# EAGLE schematic DC_brake(PIC) (EAGLE 7.4.0)
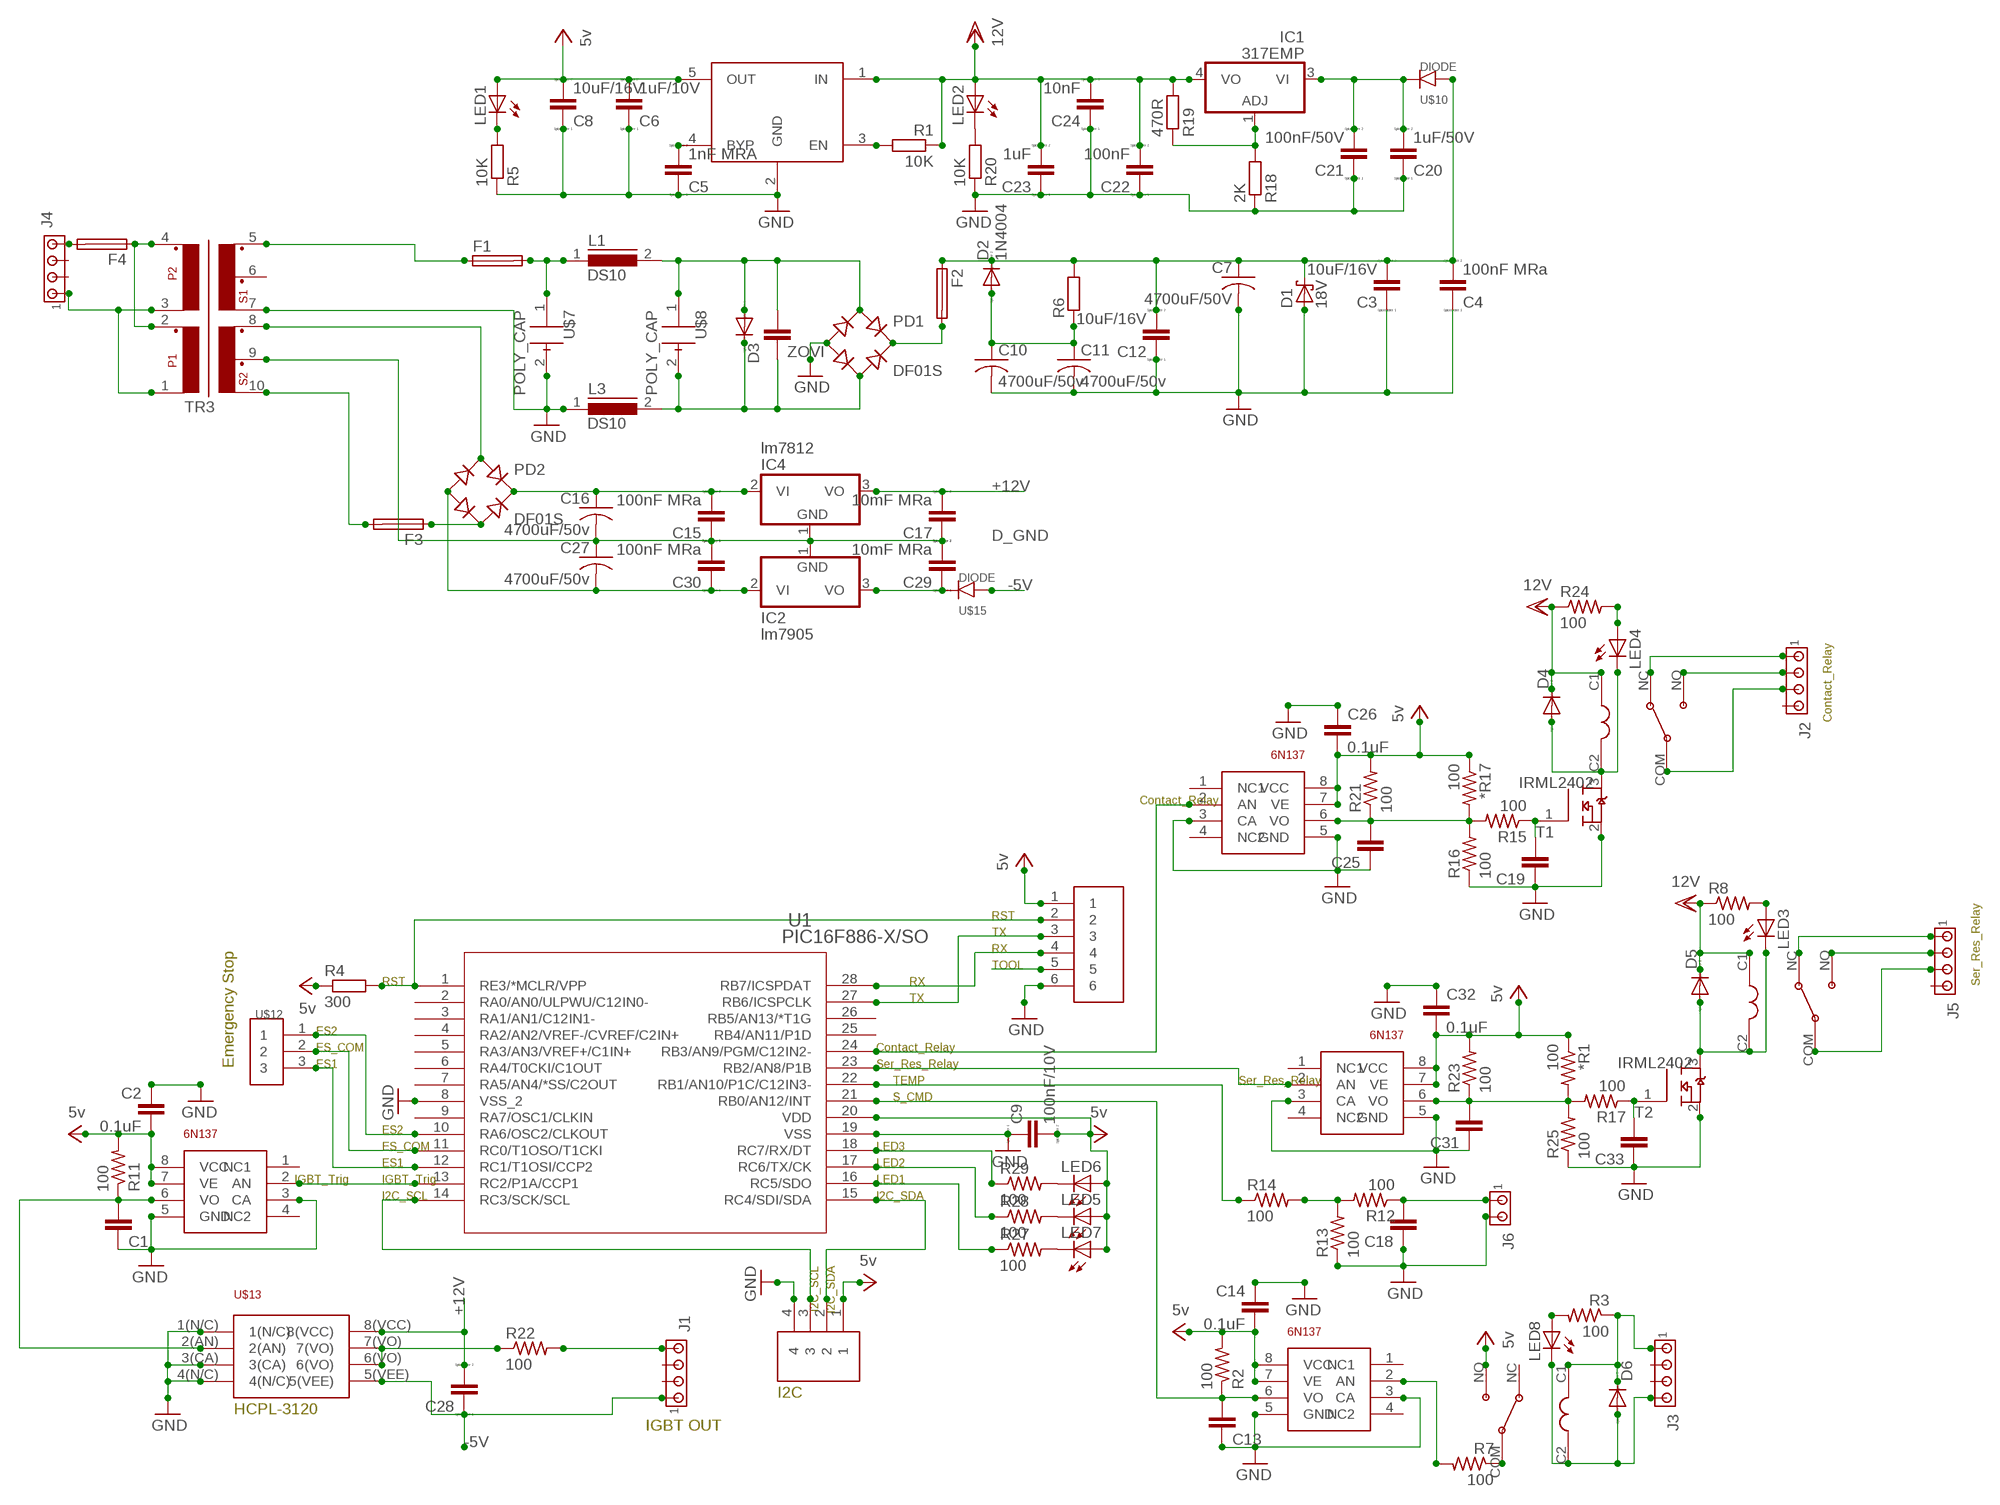
[diagram p0: schematic, sheet 1]

## Parts
*R1  100  R-US_R0603  [R0603]
*R17  100  R-US_R0603  [R0603]
C1  C-EUC0603  [C0603]
C2  0.1uF  C-EUC0603  [C0603]
C3  10uF/16V  CC1206  [C1206]
C4  100nF MRa  CC0603  [C0603]
C5  1nF MRA  CC0603  [C0603]
C6  1uF/10V  CC0603  [C0603]
C7  4700uF/50V  C-US050-075X075  [C050-075X075]
C8  10uF/16V  CC1206  [C1206]
C9  100nF/10V  CC0603  [C0603]
C10  4700uF/50v  C-US050-075X075  [C050-075X075]
C11  4700uF/50v  C-US050-075X075  [C050-075X075]
C12  10uF/16V  CC1206  [C1206]
C13  C-EUC0603  [C0603]
C14  0.1uF  C-EUC0603  [C0603]
C15  100nF MRa  CC0603  [C0603]
C16  4700uF/50v  C-US050-075X075  [C050-075X075]
C17  10mF MRa  CC0603  [C0603]
C18  C-EUC0603  [C0603]
C19  C-EUC0603  [C0603]
C20  1uF/50V  CC1206  [C1206]
C21  100nF/50V  CC0603  [C0603]
C22  100nF  CC0603  [C0603]
C23  1uF  CC0603  [C0603]
C24  10nF  CC0603  [C0603]
C25  C-EUC0603  [C0603]
C26  0.1uF  C-EUC0603  [C0603]
C27  4700uF/50v  C-US050-075X075  [C050-075X075]
C28  C  [C0805]
C29  10mF MRa  CC0603  [C0603]
C30  100nF MRa  CC0603  [C0603]
C31  C-EUC0603  [C0603]
C32  0.1uF  C-EUC0603  [C0603]
C33  C-EUC0603  [C0603]
D1  18V  SCHOTTKY-DIODESMC  [SMC]
D2  1N4004  [DO41-10]
D3  1N4933  [DO41-10]
D4  DIODE-DO214AC  [DO214AC]
D5  DIODE-DO214AC  [DO214AC]
D6  DIODE-DO214AC  [DO214AC]
F1  19560  [19560]
F2  19560  [19560]
F3  19560  [19560]
F4  19560  [19560]
IC1  317EMP  [SOT223]
IC2  lm7905  7908T  [TO220H]
IC4  lm7812  7908T  [TO220H]
J1  MTA04-156  [1X4MTA]
J2  MTA04-156  [1X4MTA]
J3  MTA04-156  [1X4MTA]
J4  MTA04-156  [1X4MTA]
J5  MTA04-156  [1X4MTA]
J6  MTA02-100  [10X02MTA]
L1  DS10  [DS10]
L3  DS10  [DS10]
LED1  LEDSML1206  [SML1206]
LED2  LEDSML1206  [SML1206]
LED3  LED3MM  [LED3MM]
LED4  LED3MM  [LED3MM]
LED5  LED3MM  [LED3MM]
LED6  LED3MM  [LED3MM]
LED7  LED3MM  [LED3MM]
LED8  LED3MM  [LED3MM]
PD1  DF01S  DBLS201G  [DBS]
PD2  DF01S  DBLS201G  [DBS]
R1  10K  R-EU_R0603  [R0603]
R2  100  R-US_R0603  [R0603]
R3  100  R-US_R0603  [R0603]
R4  300  R-EU_R0603  [R0603]
R5  10K  R-EU_R0603  [R0603]
R6  R-EU_0411/12  [0411/12]
R7  100  R-US_R0603  [R0603]
R8  100  R-US_R0603  [R0603]
R11  100  R-US_R0603  [R0603]
R12  100  R-US_R0603  [R0603]
R13  100  R-US_R0603  [R0603]
R14  100  R-US_R0603  [R0603]
R15  100  R-US_R0603  [R0603]
R16  100  R-US_R0603  [R0603]
R17  100  R-US_R0603  [R0603]
R18  2K  R-EU_R0603  [R0603]
R19  470R  R-EU_R0603  [R0603]
R20  10K  R-EU_R0603  [R0603]
R21  100  R-US_R0603  [R0603]
R22  100  R-US_R0603  [R0603]
R23  100  R-US_R0603  [R0603]
R24  100  R-US_R0603  [R0603]
R25  100  R-US_R0603  [R0603]
R27  100  R-US_R0603  [R0603]
R28  100  R-US_R0603  [R0603]
R29  100  R-US_R0603  [R0603]
T1  IRML2402  [IRML2402]
T2  IRML2402  [IRML2402]
TR3  OB115/6M  [OB115/6M]
U1  PIC16F886-X/SO  PIC16F883-X/SO  [SOIC28-W_MC]
U$1  MIC5205-5.YMS  [SMD]
U$2  6N137  [6N137]
U$3  6N137  [6N137]
U$4  6PIN  [6PIN]
U$5  RELAY  [RELAY]
U$6  4PIN  [4PIN]
U$7  POLY_CAP  [POL_CAP]
U$8  POLY_CAP  [POL_CAP]
U$9  RELAY  [RELAY]
U$10  DIODE  [DIODE]
U$11  6N137  [6N137]
U$12  3PIN  [3PIN]
U$13  HCPL-3120  [HCPL-3120]
U$14  6N137  [6N137]
U$15  DIODE  [DIODE]
U$16  RELAY  [RELAY]
ZOVI  C5/7.2  [C5B7.2]

## Nets
+12V: C17.2 C28.2 IC4.3(VO) U$13.8(VCC)
-5V: C28.1 J1.1 U$13.5(VEE) U$15.-(+)
CONTACT_RELAY: U1.24(RB3/AN9/PGM/C12IN2-) U$11.2(AN)
D_GND: C15.1 C16.2 C17.1 C27.1 C29.2 C30.2 IC2.1(GND) IC4.1(GND) TR3.9
ES1: U1.12(RC1/T1OSI/CCP2) U$12.3
ES2: U1.10(RA6/OSC2/CLKOUT) U$12.1
ES_COM: U1.11(RC0/T1OSO/T1CKI) U$12.2
GND: C1.1 C2.1 C3.1 C4.1 C5.1 C6.1 C7.2 C8.1 C9.1 C10.2 C11.2 C12.1 C13.1 C14.1 C18.1 C19.1 C20.1 C21.1 C22.1 C23.1 C24.1 C25.1 C26.1 C31.1 C32.1 C33.1 D1.A J6.2 L3.1 PD1.- R5.1 R13.1 R16.1 R18.1 R20.1 R25.1 T1.2(S1) T2.2(S1) TR3.7 U1.8(VSS_2) U1.19(VSS) U$1.2(GND) U$2.3(CA) U$2.5(GND) U$3.3(CA) U$3.5(GND) U$4.6 U$6.4 U$7.2 U$11.3(CA) U$11.5(GND) U$13.1(N/C) U$13.3(CA) U$13.4(N/C) U$14.3(CA) U$14.5(GND)
I2C_SCL: U1.14(RC3/SCK/SCL) U$6.3
I2C_SDA: U1.15(RC4/SDI/SDA) U$6.2
IGBT_TRIG: U1.13(RC2/P1A/CCP1) U$3.2(AN)
LED1: R27.1 U1.16(RC5/SDO)
LED2: R28.1 U1.17(RC6/TX/CK)
LED3: R29.1 U1.18(RC7/RX/DT)
N$1: C29.1 IC2.3(VO) U$15.+(-)
N$2: C5.2 U$1.4(BYP)
N$3: F1.2 L1.1 U$7.1
N$4: R1.2 U$1.3(EN)
N$5: F4.1 TR3.2 TR3.4
N$6: F1.1 TR3.5
N$7: J4.1 TR3.1 TR3.3
N$8: F4.2 J4.4
N$9: J1.4 R22.2
N$10: C10.1 C11.1 D2.A R6.1
N$11: F3.2 TR3.10
N$12: J2.1 U$9.NC
N$13: C3.2 C4.2 C7.1 C12.2 D1.C D2.C F2.1 R6.2 U$10.-(+)
N$14: LED1.C R5.2
N$15: D6.A J3.4 LED8.K(C) U$5.C2
N$16: LED8.A R3.2
N$17: R7.2 U$2.2(AN)
N$18: R7.1 U$5.COM
N$19: D6.C J3.1 R3.1 U$5.C1
N$20: D5.A LED3.K(C) T2.3(D1) U$16.C2
N$21: LED3.A R8.2
N$22: J5.1 U$16.NC
N$23: J5.2 U$16.NO
N$24: J5.3 U$16.COM
N$26: PD2.AC1 TR3.8
N$27: D3.A L1.2 PD1.AC1 U$8.1 ZOVI.2
N$28: D3.C L3.2 PD1.AC2 U$8.2 ZOVI.1
N$29: F3.1 PD2.AC2
N$30: J2.2 U$9.NO
N$31: C1.2 R11.1 U$3.6(VO) U$13.2(AN)
N$32: C15.2 C16.1 IC4.2(VI) PD2.+
N$33: C18.2 J6.1 R12.1
N$34: J2.3 U$9.COM
N$35: F2.2 PD1.+
N$37: R12.2 R13.2 R14.2
N$38: C19.2 R15.1 T1.1(G1)
N$39: D4.A LED4.K(C) T1.3(D1) U$9.C2
N$40: C33.2 R17.1 T2.1(G1)
N$41: *R17.2 C25.2 R15.2 R16.2 R21.1 U$11.6(VO)
N$42: LED2.C R20.2
N$43: IC1.1(ADJ) R18.2 R19.1
N$44: C20.2 C21.2 IC1.3(VI) U$10.+(-)
N$45: C27.2 C30.1 IC2.2(VI) PD2.-
N$47: R22.1 U$13.6(VO) U$13.7(VO)
N$48: *R1.2 C31.2 R17.2 R23.1 R25.2 U$14.6(VO)
N$50: LED4.A R24.2
N$52: LED7.K(C) R27.2
N$54: LED5.K(C) R28.2
N$55: LED6.K(C) R29.2
RST: R4.2 U1.1(RE3/*MCLR/VPP) U$4.2
RX: U1.28(RB7/ICSPDAT) U$4.4
S_CMD: C13.2 R2.1 U1.21(RB0/AN12/INT) U$2.6(VO)
SER_RES_RELAY: U1.23(RB2/AN8/P1B) U$14.2(AN)
TEMP: R14.1 U1.22(RB1/AN10/P1C/C12IN3-)
TOOL: U$4.5
TX: U1.27(RB6/ICSPCLK) U$4.3
VCC: *R1.1 *R17.1 C2.2 C6.2 C8.2 C9.2 C14.2 C26.2 C32.2 LED1.A LED5.A LED6.A LED7.A R2.2 R4.1 R11.2 R21.2 R23.2 U1.20(VDD) U$1.5(OUT) U$2.7(VE) U$2.8(VCC) U$3.7(VE) U$3.8(VCC) U$4.1 U$5.NO U$6.1 U$11.7(VE) U$11.8(VCC) U$14.7(VE) U$14.8(VCC) ; supply symbol labelled 5v
VDD: C22.2 C23.2 C24.2 D4.C D5.C IC1.4(VO) LED2.A R1.1 R8.1 R19.2 R24.1 U$1.1(IN) U$9.C1 U$16.C1 ; supply symbol labelled 12V
Unconnected: J1.2 J1.3 J2.4 J3.2 J3.3 J4.2 J4.3 J5.4 TR3.6 U1.2(RA0/AN0/ULPWU/C12IN0-) U1.3(RA1/AN1/C12IN1-) U1.4(RA2/AN2/VREF-/CVREF/C2IN+) U1.5(RA3/AN3/VREF+/C1IN+) U1.6(RA4/T0CKI/C1OUT) U1.7(RA5/AN4/*SS/C2OUT) U1.9(RA7/OSC1/CLKIN) U1.25(RB4/AN11/P1D) U1.26(RB5/AN13/*T1G) U$2.1(NC1) U$2.4(NC2) U$3.1(NC1) U$3.4(NC2) U$5.NC U$11.1(NC1) U$11.4(NC2) U$14.1(NC1) U$14.4(NC2)

## Notes on the sheet
- Contact_Relay
- Contact_Relay
- RST
- TX
- RX
- TOOL
- RST | RX | Ser_Res_Relay
- TX
- ES2
- ES_COM | Contact_Relay
- Emergency Stop | ES1 | Ser_Res_Relay
- TEMP | Ser_Res_Relay
- S_CMD
- ES2
- ES_COM | LED3
- ES1 | LED2
- IGBT_Trig | IGBT_Trig | LED1
- I2C_SCL | I2C_SDA
- I2C_SCL | I2C_SDA
- I2C
- HCPL-3120
- IGBT OUT

## Library data of the parts
*R1 *R17 R2 R3 R7 R8 R11-R17 R21-R25 R27-R29 = resistor:R-US_: RESISTOR, American symbol
C1 C2 C13 C14 C18 C19 C25 C26 C31-C33 = rcl:C-EU: CAPACITOR, European symbol
C3-C6 C8 C9 C12 C15 C17 C20-C24 C28-C30 = eagle-ltspice:C: CAPACITOR, European symbol; SPICEMODEL: NONE; SPICEPREFIX: C
C7 C10 C11 C16 C27 = rcl:C-US: CAPACITOR, American symbol
D1 = diode:SCHOTTKY-DIODE: Schottky Diode
D2 = diode:1N4004: DIODE general purpose rectifier, 1 A
D3 = diode:1N4933: DIODE fast recovery rectifier, 1A
D4-D6 = diode:DIODE-: DIODE
F1-F4 = fuse:19560: FUSE HOLDER TR5, Wickmann; MPN: 56000001009; OC_FARNELL: 1185363; OC_NEWARK: 15P8392
IC1 = linear:*317: Positive VOLTAGE REGULATOR
IC2 IC4 = linear:79*: Negative VOLTAGE REGULATOR
J1-J5 = con-amp:MTA04-156: AMP connector
J6 = con-amp:MTA02-100: AMP connector
L1 L3 = inductors:DS10: INDUCTOR
LED1-LED8 = led:LED: LED OSRAM: - CHIPLED LG R971, LG N971, LY N971, LG Q971, LY Q971, LO R971, LY R971 LH N974, LH R974 LS Q976, LO Q976, LY Q976 LO Q996 - Hyper CHIPLED LW Q18S LB Q993, LB Q99A, LB R99A - SideLED LS A670, LO A670, LY A670, LG A670, LP A670 LB A673, LV A673, LT A673, LW A673 LH A674 LY A675 LS A676, LA A676, LO A676, LY A676, LW A676 LS A679, LY A679, LG A679 - Hyper Micro SIDELED® LS Y876, LA Y876, LO Y876, LY Y876 LT Y87S - SmartLED LW L88C, LW L88S LB L89C, LB L89S, LG L890 LS L89K, LO L89K, LY L89K LS L896, LA L896, LO L896, LY L896 - TOPLED LS T670, LO T670, LY T670, LG T670, LP T670 LSG T670, LSP T670, LSY T670, LOP T670, LYG T670 LG T671, LOG T671, LSG T671 LB T673, LV T673, LT T673, LW T673 LH T674 LS T676, LA T676, LO T676, LY T676, LB T676, LH T676, LSB T676, LW T676 LB T67C, LV T67C, LT T67C, LS T67K, LO T67K, LY T67K, LW E67C LS E67B, LA E67B, LO E67B, LY E67B, LB E67C, LV E67C, LT E67C LW T67C LS T679, LY T679, LG T679 LS T770, LO T770, LY T770, LG T770, LP T770 LB T773, LV T773, LT T773, LW T773 LH T774 LS E675, LA E675, LY E675, LS T675 LS T776, LA T776, LO T776, LY T776, LB T776 LHGB T686 LT T68C, LB T68C - Hyper Mini TOPLED® LB M676 - Mini TOPLED Santana® LG M470 LS M47K, LO M47K, LY M47K Source: http://www.osram.convergy.de LUXEON: - LUMILED® LXK2-PW12-R00, LXK2-PW12-S00, LXK2-PW14-U00, LXK2-PW14-V00 LXK2-PM12-R00, LXK2-PM12-S00, LXK2-PM14-U00 LXK2-PE12-Q00, LXK2-PE12-R00, LXK2-PE12-S00, LXK2-PE14-T00, LXK2-PE14-U00 LXK2-PB12-K00, LXK2-PB12-L00, LXK2-PB12-M00, LXK2-PB14-N00, LXK2-PB14-P00, LXK2-PB14-Q00 LXK2-PR12-L00, LXK2-PR12-M00, LXK2-PR14-Q00, LXK2-PR14-R00 LXK2-PD12-Q00, LXK2-PD12-R00, LXK2-PD12-S00 LXK2-PH12-R00, LXK2-PH12-S00 LXK2-PL12-P00, LXK2-PL12-Q00, LXK2-PL12-R00 Source: www.luxeon.com KINGBRIGHT: KA-3528ASYC Source: www.kingbright.com
PD1 PD2 = rectifier:DB?*G: Single Phase 1.0 AMP Glass Passivated Bridge Rectifier Taiwan Semiconductor Co.,Ltd. - TSC Source: http://www.taiwansemi.com/TSCbig5/ezcatfiles/cust/img/img/db101g.pdf http://www.ts.com.tw/db/pictures/modules/PDT/PDT060207001/DBLS201G.pdf
R1 R4 R5 R18-R20 = rcl:R-EU_: RESISTOR, European symbol
R6 = resistor:R-EU_: RESISTOR, European symbol
T1 T2 = irlml2402:IRML2402
TR3 = trafo:OB115/6M: TRANSFORMER 2 primary winding, 2 secondary windings with tap, mounting holes BLOCK
U1 = pic16f883:PIC16F883-X/SO
U$1 = mic5205_5.0:MIC5205-5.YMS
U$2 U$3 U$11 U$14 = 6n137:6N137
U$4 = 6pin:6PIN
U$5 U$9 U$16 = relay:RELAY
U$6 = 4pin:4PIN
U$7 U$8 = poly_cap:POLY_CAP
U$10 U$15 = diode:DIODE
U$12 = 3pin:3PIN
U$13 = hcpl_3120:HCPL-3120
ZOVI = capacitor-wima:C: CAPACITOR naming: grid - package width